# EAGLE design Dimmer_V3 (EAGLE 5.00)
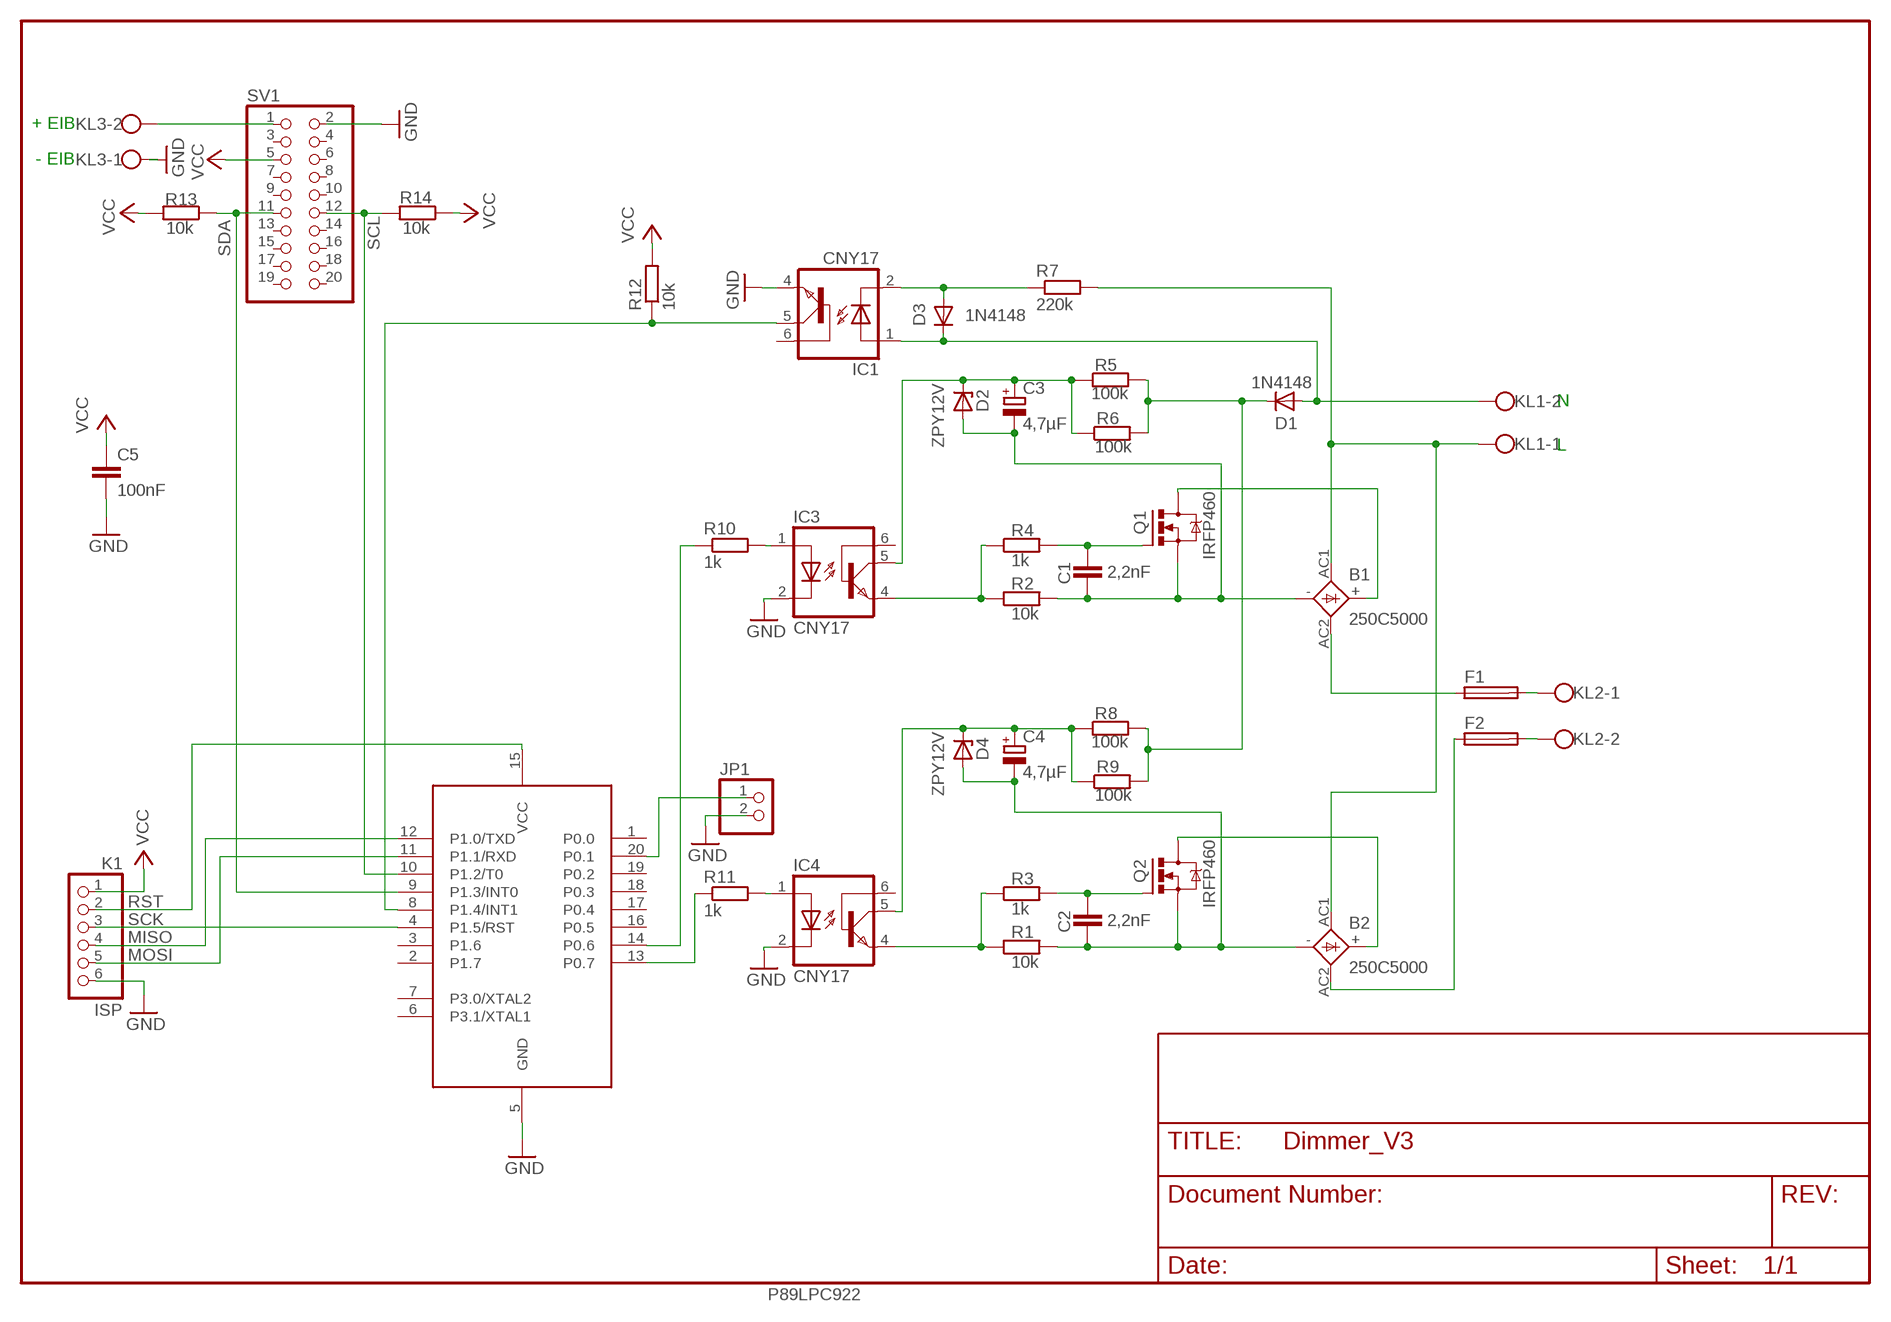
[diagram p0: schematic, sheet 1]

## Parts
B1  250C5000  SKB32  [SKB32]
B2  250C5000  SKB32  [SKB32]
C1  2,2nF  C-EU025-024X044  [C025-024X044]
C2  2,2nF  C-EU025-024X044  [C025-024X044]
C3  4,7µF  CPOL-EUE2-4  [E2-4]
C4  4,7µF  CPOL-EUE2-4  [E2-4]
C5  100nF  C-EU025-024X044  [C025-024X044]
D1  1N4148  [DO35-10]
D2  ZPY12V  ZPY  [DO41Z10]
D3  1N4148  [DO35-10]
D4  ZPY12V  ZPY  [DO41Z10]
F1  SH22,5  [SH22,5]
F2  SH22,5  [SH22,5]
IC1  CNY17  [DIL06]
IC2  89LPC922  [DIL20]
IC3  CNY17  [DIL06]
IC4  CNY17  [DIL06]
JP1  PINHD-1X2  [1X02]
K1  ISP  PINHD-1X6  [1X06]
KL1  W237-102  [W237-102]
KL2  W237-102  [W237-102]
KL3  W237-102  [W237-102]
Q1  IRFP460  IRFPC40  [TO247BV]
Q2  IRFP460  IRFPC40  [TO247BV]
R1  10k  R-EU_0204/7  [0204/7]
R2  10k  R-EU_0204/7  [0204/7]
R3  1k  R-EU_0204/7  [0204/7]
R4  1k  R-EU_0204/7  [0204/7]
R5  100k  R-EU_0204/7  [0204/7]
R6  100k  R-EU_0204/7  [0204/7]
R7  220k  R-EU_0204/7  [0204/7]
R8  100k  R-EU_0204/7  [0204/7]
R9  100k  R-EU_0204/7  [0204/7]
R10  1k  R-EU_0204/7  [0204/7]
R11  1k  R-EU_0204/7  [0204/7]
R12  10k  R-EU_0204/7  [0204/7]
R13  10k  R-EU_0204/7  [0204/7]
R14  10k  R-EU_0204/7  [0204/7]
SV1  PINHD-2X10  [2X10]

## Nets
GND: C5.2 IC1.4(EMI) IC2.5(GND) IC3.2(C) IC4.2(C) JP1.2 K1.6 KL3.1 SV1.2
MISO: IC2.12(P1.0/TXD) K1.4
MOSI: IC2.11(P1.1/RXD) K1.5
N$1: IC1.5(COL) IC2.8(P1.4/INT1) R12.1
N$2: D3.A IC1.2(C) R7.1
N$3: D1.A D3.C IC1.1(A) KL1.2
N$4: IC3.1(A) R10.2
N$5: IC2.14(P0.6) R10.1
N$6: IC3.4(EMI) R2.1 R4.1
N$7: IC2.13(P0.7) R11.1
N$8: C1.1 Q1.G R4.2
N$9: B1.+ Q1.D
N$10: B1.AC1 B2.AC1 KL1.1 R7.2
N$11: B1.- C1.2 C3.- D2.A Q1.S R2.2
N$12: D1.C R5.2 R6.2 R8.2 R9.2
N$13: C3.+ D2.C IC3.5(COL) R5.1 R6.1
N$14: IC4.1(A) R11.2
N$15: IC4.4(EMI) R1.1 R3.1
N$16: C2.1 Q2.G R3.2
N$17: B2.+ Q2.D
N$18: F1.2 KL2.1
N$19: F2.2 KL2.2
N$20: KL3.2 SV1.1
N$21: C4.+ D4.C IC4.5(COL) R8.1 R9.1
N$22: B2.- C2.2 C4.- D4.A Q2.S R1.2
N$23: B1.AC2 F1.1
N$24: B2.AC2 F2.1
N$25: IC2.20(P0.1) JP1.1
RST: IC2.15(VCC) K1.2
SCK: IC2.4(P1.5/RST) K1.3
SCL: IC2.10(P1.2/T0) R14.2 SV1.12
SDA: IC2.9(P1.3/INT0) R13.1 SV1.11
VCC: C5.1 K1.1 R12.2 R13.2 R14.1 SV1.5
Unconnected: IC1.6(BAS) IC2.1(P0.0) IC2.2(P1.7) IC2.3(P1.6) IC2.6(P3.1/XTAL1) IC2.7(P3.0/XTAL2) IC2.16(P0.5) IC2.17(P0.4) IC2.18(P0.3) IC2.19(P0.2) IC3.6(BAS) IC4.6(BAS) SV1.3 SV1.4 SV1.6 SV1.7 SV1.8 SV1.9 SV1.10 SV1.13 SV1.14 SV1.15 SV1.16 SV1.17 SV1.18 SV1.19 SV1.20

## Notes on the sheet
- + EIB
- - EIB
- N
- L
- P89LPC922

## Library data of the parts
B1 B2 = rectifier:SKB32: SEMIKRON RECTIFIER
C1 C2 C5 = rcl:C-EU: CAPACITOR, European symbol
C3 C4 = rcl:CPOL-EU: POLARIZED CAPACITOR, European symbol
D1 D3 = diode:1N4148: DIODE high speed (Philips)
D2 D4 = diode:ZPY: Z DIODE 1 W
F1 F2 = fuse:SH22,5: FUSE HOLDER grid 22,5 mm, OGN0031 8201, Schurter (Buerklin)
IC1 IC3 IC4 = optocoupler:CNY17: SIEMENS OPTO COUPLER
IC2 = micro-philips:89LPC922
JP1 = pinhead:PINHD-1X2: PIN HEADER
K1 = pinhead:PINHD-1X6: PIN HEADER
KL1-KL3 = con-wago-500:W237-102: WAGO SCREW CLAMP
Q1 Q2 = transistor-power:IRFPC40: N-CHANNEL MOS FET
R1-R14 = rcl:R-EU_: RESISTOR, European symbol
SV1 = pinhead:PINHD-2X10: PIN HEADER

## Board
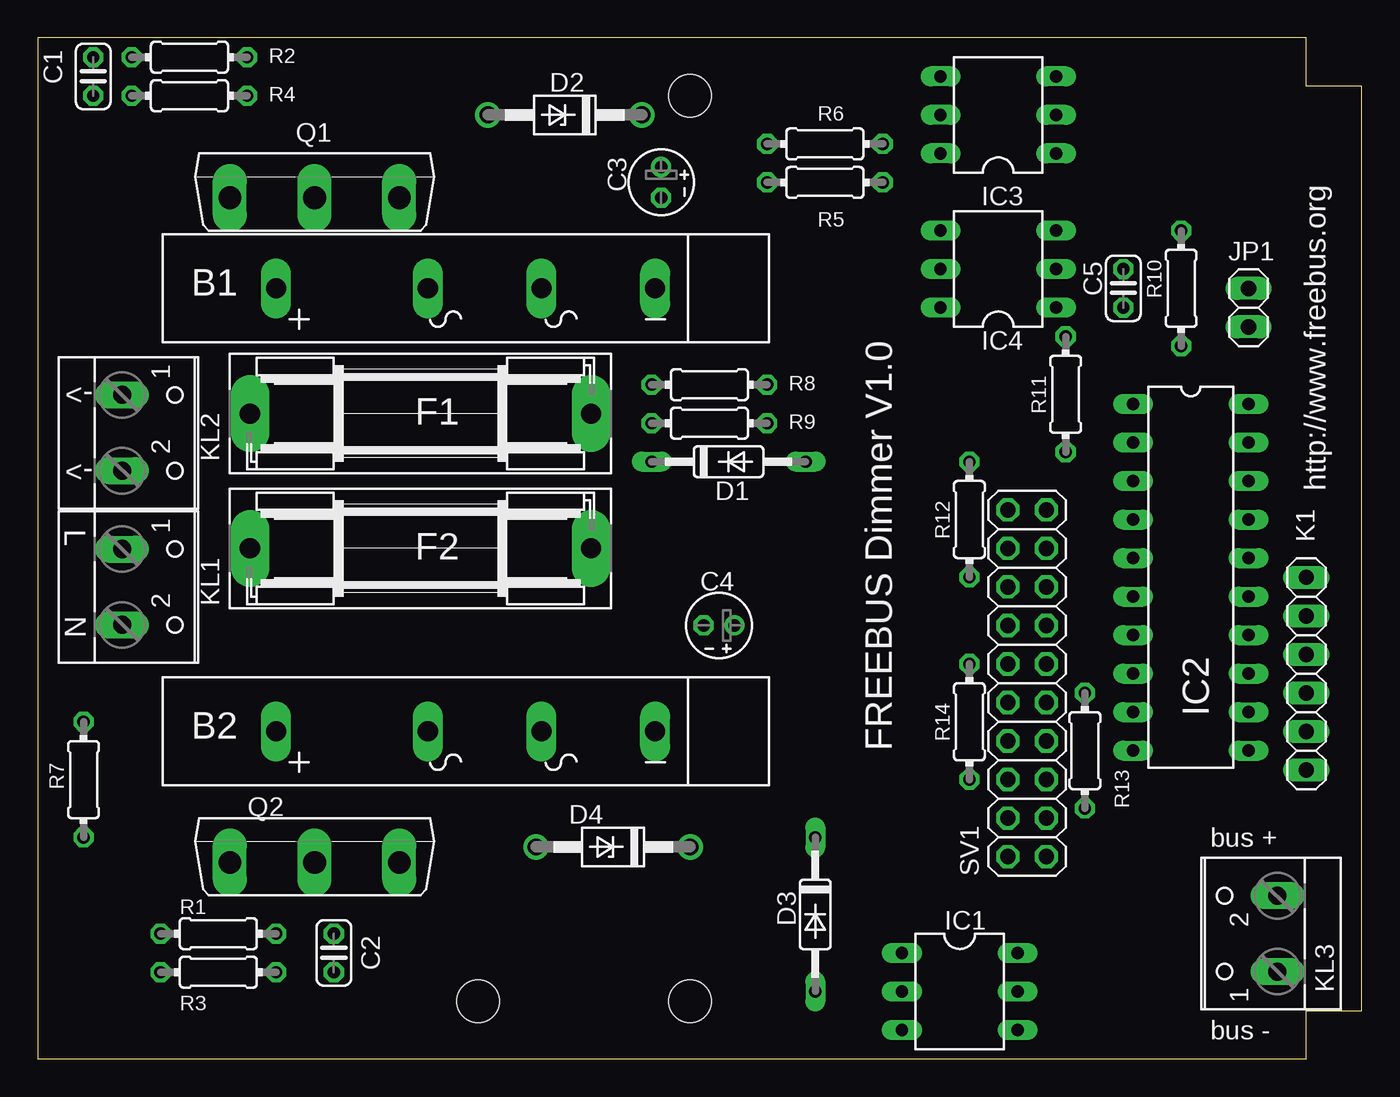
[diagram p1: board, top side]
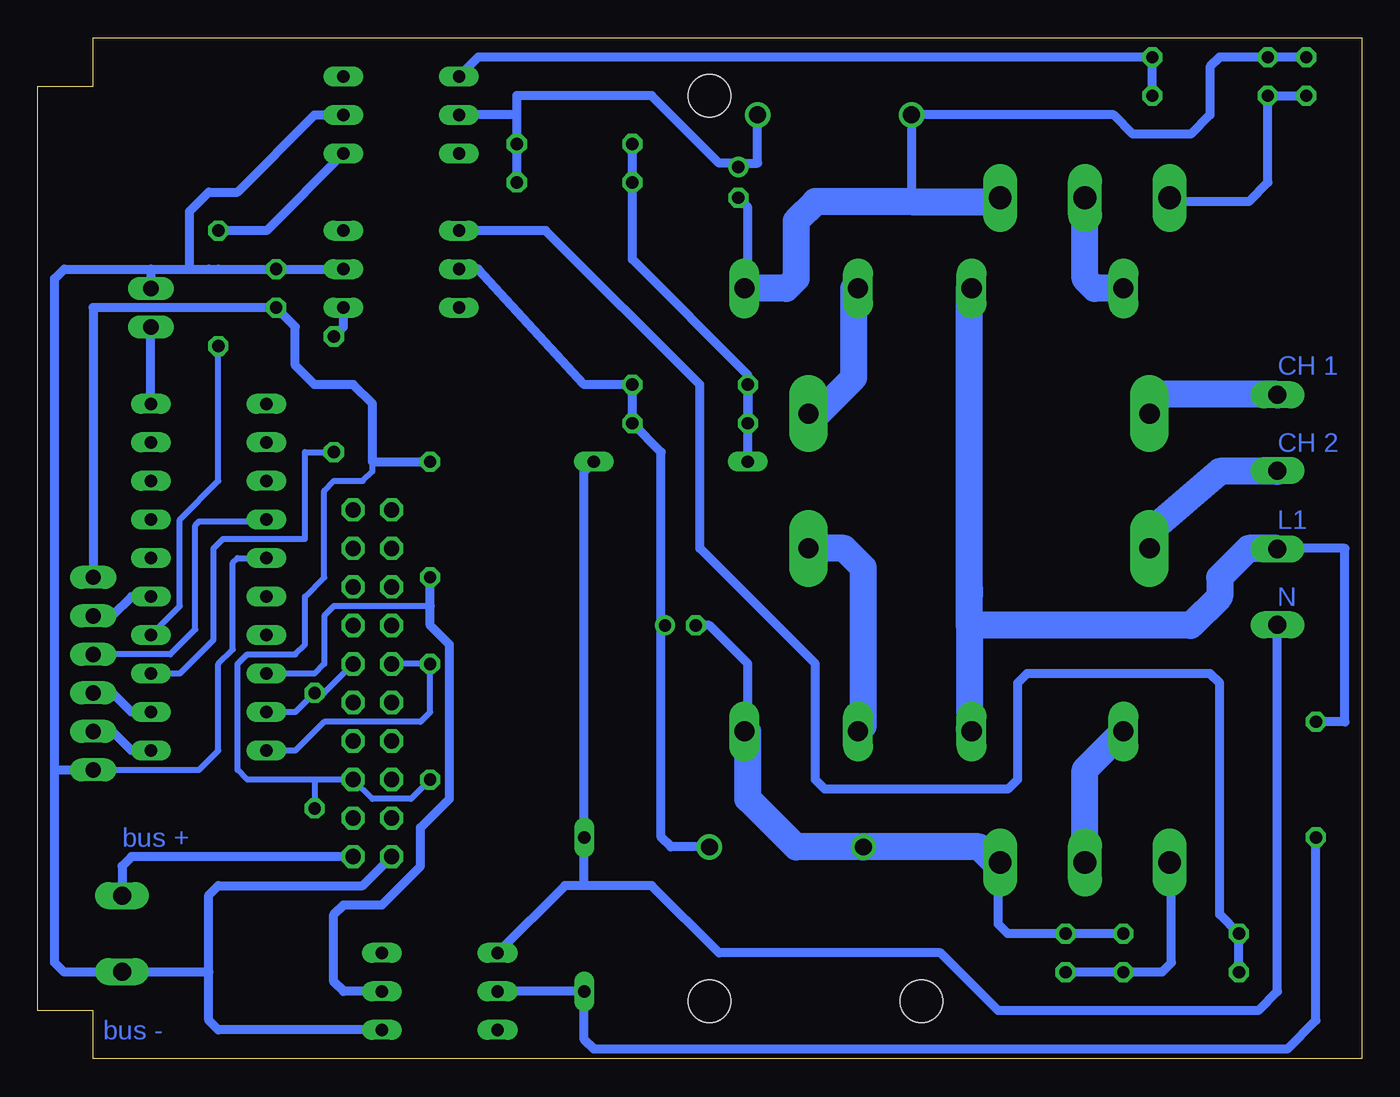
[diagram p2: board, bottom side, seen from below]

Size 87.3 x 67.31 mm. Coordinates in mm from the lower left corner, seen from the top.
Outline: 0,0.01 83.66,0 83.66,3.18 87.3,3.18 87.3,64.13 83.66,64.13 83.66,67.31 0,67.31 0,0.01
Copper layers (1*16): Top 0.035mm / dielectric 1.5mm / Bottom 0.035mm
Design rules "default *": minimum track width 10mil, minimum drill 24mil, track to track 16mil, track to pad 16mil, pad to pad 16mil, via to via 16mil, smd to smd 8mil, copper to edge 10mil, drill to drill 10mil, minimum pad ring 10mil, minimum via ring 8mil, stop-mask expansion 4mil, vias tented up to drill 0mil, thermal gap 10mil
Holes 2.8 mm at 43.02,3.81 43.02,63.5 29.04,3.81

### Footprints (pad centres in the part's own frame; a part is rotated, then mirrored left to right if it is on the bottom)
SKB32 = drill 1.321 long: + -13.97,0; - 11.024,0; AC1 -3.962,0; AC2 3.531,0
C025-024X044 = drill 0.813 octagon: 1 -1.27,0; 2 1.27,0
E2-4 = drill 0.813 pad 1.27 round: + -1.016,0 | drill 0.813 pad 1.27 octagon: - 1.016,0
DO35-10 = drill 0.813 long: A 5.08,0; C -5.08,0
DO41Z10 = drill 1.118 round: A 5.08,0; C -5.08,0
SH22,5 = drill 1.321 pad 2.54 long: 1 -11.252,0; 2 11.252,0
DIL06 = drill 0.813 long: 1 -2.54,-3.81; 2 0,-3.81; 3 2.54,-3.81; 4 2.54,3.81; 5 0,3.81; 6 -2.54,3.81
DIL20 = drill 0.813 long: 1 -11.43,-3.81; 2 -8.89,-3.81; 3 -6.35,-3.81; 4 -3.81,-3.81; 5 -1.27,-3.81; 6 1.27,-3.81; 7 3.81,-3.81; 8 6.35,-3.81; 9 8.89,-3.81; 10 11.43,-3.81; 11 11.43,3.81; 12 8.89,3.81; 13 6.35,3.81; 14 3.81,3.81; 15 1.27,3.81; 16 -1.27,3.81; 17 -3.81,3.81; 18 -6.35,3.81; 19 -8.89,3.81; 20 -11.43,3.81
1X02 = drill 1.016 long: 1 -1.27,0; 2 1.27,0
1X06 = drill 1.016 long: 1 -6.35,0; 2 -3.81,0; 3 -1.27,0; 4 1.27,0; 5 3.81,0; 6 6.35,0
W237-102 = drill 1.194 long: 1 -2.5,-1.27; 2 2.5,-1.27
TO247BV = drill 1.499 long: D 0,-2.921; G -5.588,-2.921; S 5.588,-2.921
0204/7 = drill 0.813 octagon: 1 -3.81,0; 2 3.81,0
2X10 = drill 1.016 octagon: 1 -11.43,-1.27; 2 -11.43,1.27; 3 -8.89,-1.27; 4 -8.89,1.27; 5 -6.35,-1.27; 6 -6.35,1.27; 7 -3.81,-1.27; 8 -3.81,1.27; 9 -1.27,-1.27; 10 -1.27,1.27; 11 1.27,-1.27; 12 1.27,1.27; 13 3.81,-1.27; 14 3.81,1.27; 15 6.35,-1.27; 16 6.35,1.27; 17 8.89,-1.27; 18 8.89,1.27; 19 11.43,-1.27; 20 11.43,1.27

### Placement (x,y rotation side)
B1  29.68,50.8 0 top
B2  29.68,21.59 0 top
C1  3.64,64.77 90 top
C2  19.52,6.98 90 top
C3  41.11,57.78 270 top
C4  44.92,28.58 180 top
C5  71.59,50.8 90 top
D1  45.55,39.37 0 top
D2  34.76,62.23 180 top
D3  51.27,9.53 270 top
D4  37.94,13.97 180 top
F1  25.23,42.54 180 top
F2  25.23,33.66 180 top
IC1  60.8,4.45 270 top
IC2  76.03,31.75 270 top
IC3  63.34,62.23 90 top
IC4  63.34,52.07 90 top
JP1  79.84,49.53 90 top
K1  83.66,25.4 270 top
KL1  6.82,31.12 270 top
KL2  6.82,41.27 270 top
KL3  80.48,8.26 90 top
Q1  18.25,59.69 0 top
Q2  18.25,15.88 0 top
R1  11.9,8.26 0 top
R2  10,66.04 180 top
R3  11.9,5.71 0 top
R4  10,63.5 180 top
R5  51.91,57.78 180 top
R6  51.91,60.32 180 top
R7  3.01,18.42 90 top
R8  44.28,44.45 180 top
R9  44.28,41.91 180 top
R10  75.4,50.8 90 top
R11  67.78,43.81 90 top
R12  61.43,35.56 90 top
R13  69.05,20.32 270 top
R14  61.43,22.23 90 top
SV1  65.24,24.77 90 top

### Tracks (layer width: path | path; a pad name or v marks a point on that pad's centre or on a via)
GND
  Bottom 0.406: IC2.5 74.13,33.02 74.45,32.7 74.45,26.99 75.4,26.04 75.4,20.32 76.67,19.05 K1.6
  Bottom 0.61: 76.03,5.71 81.75,5.71 | 83.66,5.71 81.79,5.71 KL3.1 81.75,5.71 | 75.4,52.07 IC4.2 | 77.3,52.07 75.4,52.07 | 77.3,52.07 76.03,52.07 | 86.19,19.05 86.19,6.35 85.56,5.71 81.75,5.71 | 86.19,19.05 86.19,51.43 85.56,52.07 79.84,52.07 | 86.19,19.05 K1.6 | 75.4,52.07 C5.2 | 79.84,52.07 77.3,52.07 | SV1.2 65.88,11.43 75.4,11.43 76.03,10.79 76.03,5.71 | IC1.4 75.4,1.91 76.03,2.54 76.03,5.71 | 77.3,52.07 77.3,55.88 76.03,57.15 74.13,57.15 69.05,62.23 IC3.2 | 79.84,52.07 JP1.2
MISO
  Bottom 0.61: IC2.12 81.11,22.86 82.39,24.13 K1.4
MOSI
  Bottom 0.61: IC2.11 81.11,20.32 82.39,21.59 K1.5
N$1
  Bottom 0.406: 61.43,29.85 67.78,29.85 68.41,29.21 68.41,26.04 69.05,25.4 IC2.8
  Bottom 0.61: R12.1 61.43,29.85 61.43,28.58 60.16,27.31 60.16,17.15 62.06,15.24 62.06,12.7 64.61,10.16 67.14,10.16 67.78,9.53 67.78,5.08 67.14,4.45 IC1.5
N$2
  Bottom 0.61: R7.1 3.01,2.54 4.92,0.64 50.63,0.64 51.27,1.27 D3.A IC1.2
N$3
  Bottom 0.61: KL1.2 5.55,4.45 6.82,3.17 23.96,3.17 27.77,6.98 42.38,6.98 46.82,11.43 51.27,11.43 | D1.A 51.27,38.73 D3.C 51.27,11.43 | 51.27,11.43 52.54,11.43 IC1.1
N$4
  Bottom 0.61: IC3.1 72.22,54.61 R10.2
N$5
  Bottom 0.406: IC2.14 77.94,29.85 77.94,35.56 75.4,38.1 R10.1
N$6
  Bottom 0.61: R4.1 R2.1 56.98,66.04 58.25,66.04 IC3.4
N$7
  Bottom 0.406: IC2.13 77.94,25.4 75.72,27.62 75.72,33.66 75.08,34.29 69.69,34.29 69.69,40 R11.1
N$8
  Bottom 0.61: C1.1 R4.2 6.18,57.78 7.46,56.52 12.54,56.52 12.54,56.64 Q1.G
N$9
  Bottom 1.778: B1.+ 17.61,50.8 18.25,51.43 Q1.D
N$10
  Bottom 0.61: R7.2 1.1,22.23 1.1,33.66 5.55,33.66 KL1.1
  Bottom 1.778: B1.AC1 25.87,50.8 25.87,31.12 | 25.87,31.12 25.87,30.48 | 7.46,33.66 6.82,33.66 | 7.46,33.66 9.36,31.75 9.36,30.48 11.27,28.58 25.87,28.58 | KL1.1 5.59,33.66 7.46,33.66 | B2.AC1 25.87,21.74 25.87,28.58 | 25.87,28.58 25.87,31.12
N$11
  Bottom 0.61: 29.68,56.52 D2.A 16.34,62.23 15.08,60.96 11.27,60.96 10,62.23 10,65.41 9.36,66.04 R2.2 C1.2 | C3.- 40.48,56.13 40.48,50.8
  Bottom 1.778: B1.- 40.48,50.8 37.94,50.8 37.3,51.43 37.3,55.24 36.03,56.52 29.68,56.52 23.96,56.52 23.96,56.64 Q1.S
N$12
  Bottom 0.61: R9.2 R8.2 D1.C 40.48,45.09 48.09,52.7 R5.2 R6.2
N$13
  Bottom 0.61: R5.1 R6.1 55.71,62.23 | D2.C 39.84,59.05 41.11,59.05 | C3.+ 41.11,59.05 | 41.11,59.05 42.38,59.05 46.82,63.5 55.71,63.5 55.71,62.23 | 55.71,62.23 IC3.5
N$14
  Bottom 0.61: R11.2 67.14,48.26 IC4.1
N$15
  Bottom 0.61: R3.1 R1.1 9.36,9.53 9.36,24.77 10,25.4 22.06,25.4 22.7,24.77 22.7,18.42 23.33,17.78 35.39,17.78 36.03,18.42 36.03,26.04 43.65,33.66 43.65,44.45 53.81,54.61 IC4.4
N$16
  Bottom 0.61: C2.1 R3.2 13.17,5.71 12.54,6.35 12.54,12.83 Q2.G
N$17
  Bottom 1.778: 18.25,12.7 Q2.D 18.25,19.05 B2.+
N$18
  Bottom 1.778: KL2.1 5.59,43.81 13.81,43.81 13.81,42.54 F1.2
N$19
  Bottom 1.778: KL2.2 5.59,38.73 9.36,38.73 13.81,34.92 | 13.81,34.92 13.81,34.29 F2.2 13.81,33.66 13.81,34.92
N$20
  Bottom 0.61: SV1.1 81.11,13.33 81.75,12.7 KL3.2
N$21
  Bottom 0.61: IC4.5 58.25,52.07 51.27,44.45 R8.1 R9.1 46.19,40 46.19,28.58 C4.+ arc-90 46.19,28.32 46.19,14.61 45.55,13.97 D4.C
N$22
  Bottom 0.61: R1.2 C2.2 23.33,8.26 23.96,8.89 23.96,12.7 23.84,12.83 Q2.S | B2.- 40.48,21.82 40.48,26.04 43.02,28.58 C4.-
  Bottom 1.778: 23.96,12.7 25.23,13.97 D4.A 37.3,13.97 40.48,17.15 40.48,21.59 B2.-
N$23
  Bottom 1.778: B1.AC2 33.49,50.8 33.49,44.91 35.85,42.54 F1.1 36.66,42.54
N$24
  Bottom 1.778: B2.AC2 32.85,21.95 32.85,32.38 34.12,33.66 F2.1 | F2.1 36.66,34.29 | F2.1 36.66,33.66
N$25
  Bottom 0.61: IC2.20 JP1.1
RST
  Bottom 0.61: IC2.15 81.11,30.48 82.39,29.21 K1.2
SCK
  Bottom 0.406: K1.3 78.58,26.67 76.92,28.32 76.92,35.18 76.67,35.43 72.1,35.43 IC2.4
SCL
  Bottom 0.406: SV1.12 R14.2 61.43,22.86 62.06,22.23 68.41,22.23 70.32,20.32 IC2.10
SDA
  Bottom 0.406: SV1.11 68.41,24.13 R13.1 70.32,22.86 IC2.9
VCC
  Bottom 0.406: R14.1 62.7,17.15 65.24,17.15 SV1.5 69.05,18.42 | 69.05,18.42 73.5,18.42 74.13,19.05 74.13,26.04 73.5,26.67 70.32,26.67 69.69,27.31 69.69,30.48 68.41,31.75 68.41,37.46 67.78,38.1 65.88,38.1 65.24,38.73 65.24,39.37 | 69.05,18.42 R13.2
  Bottom 0.61: R12.2 65.24,39.37 65.24,43.18 66.51,44.45 69.05,44.45 70.32,45.72 70.32,48.26 C5.1 83.66,49.53 K1.1

### Text on the board
Bottom: CH 1 | CH 2 | L1 | N | bus + | bus -
tPlace: bus + | bus -
tNames: -> | -> | http://www.freebus.org | L | N | FREEBUS Dimmer V1.0